# Altium schematic sheet SML-230109PCB2__NFC.SchDoc
size A4; Organization: STAR Electrónica S.L.; Address1: Póligono industrial de Sárdoma; Address2: Avda. do Freixo, 32; Address3: 36214 - Vigo (Pontevedra); Address4: España; DocumentNumber: 2; SheetNumber: 2; SheetTotal: 2
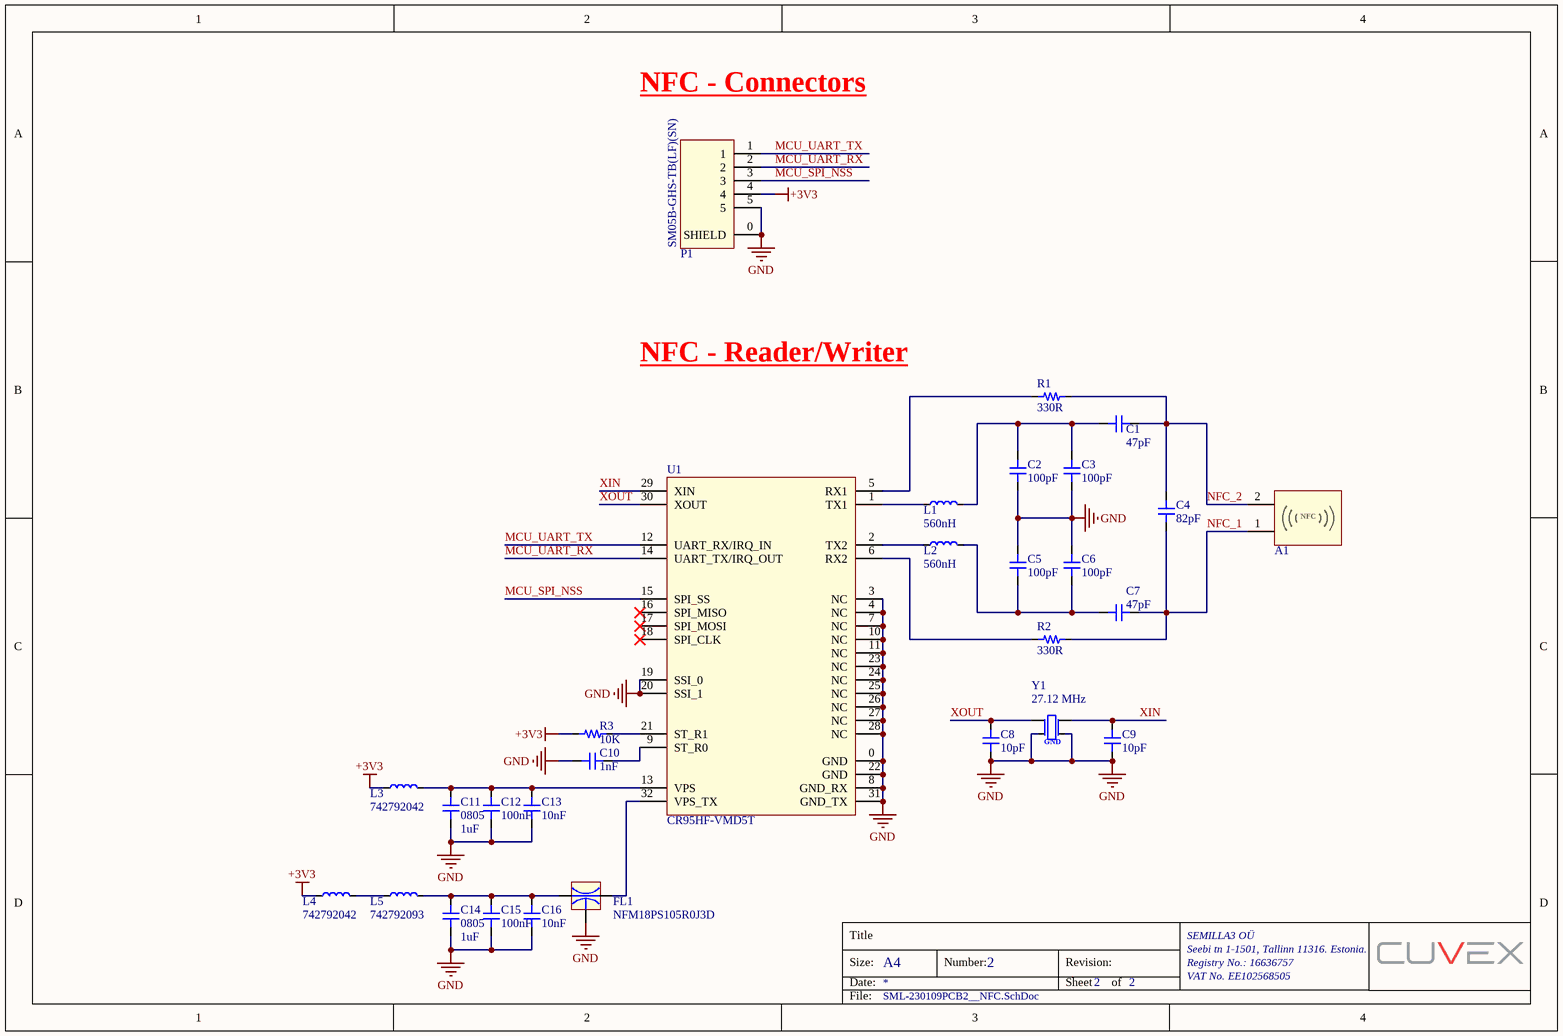
[diagram p0: SML-230109PCB2__NFC.SchDoc]

## Parts
A1  .  [ANT-PCB__NFC-MODEL-1]  (value not drawn)  (net tie, no BOM)
C1  value 47pF  [[G] CAP-MLCC__0603]  (hidden comment: .)
C2  value 100pF  [[G] CAP-MLCC__0603]  (hidden comment: .)
C3  value 100pF  [[G] CAP-MLCC__0603]  (hidden comment: .)
C4  value 82pF  [[G] CAP-MLCC__0603]  (hidden comment: .)
C5  value 100pF  [[G] CAP-MLCC__0603]  (hidden comment: .)
C6  value 100pF  [[G] CAP-MLCC__0603]  (hidden comment: .)
C7  value 47pF  [[G] CAP-MLCC__0603]  (hidden comment: .)
C8  value 10pF  [[G] CAP-MLCC__0603]  (hidden comment: .)
C9  value 10pF  [[G] CAP-MLCC__0603]  (hidden comment: .)
C10  value 1nF  [[G] CAP-MLCC__0603]  (hidden comment: .)
C11  value 1uF  [06] - Package: 0805  [[G] CAP-MLCC__0805]  (hidden comment: .)
C12  value 100nF  [[G] CAP-MLCC__0603]  (hidden comment: .)
C13  value 10nF  [[G] CAP-MLCC__0603]  (hidden comment: .)
C14  value 1uF  [06] - Package: 0805  [[G] CAP-MLCC__0805]  (hidden comment: .)
C15  value 100nF  [[G] CAP-MLCC__0603]  (hidden comment: .)
C16  value 10nF  [[G] CAP-MLCC__0603]  (hidden comment: .)
FL1  .  [EMIFIL-0603__NFM18PS]  (value not drawn)
L1  value 560nH  [[G] IND__0805]  (hidden comment: .)
L2  value 560nH  [[G] IND__0805]  (hidden comment: .)
L3  [01] - MPN Code: 742792042  [[G] IND__0805]  (hidden comment: .)
L4  [01] - MPN Code: 742792042  [[G] IND__0805]  (hidden comment: .)
L5  [01] - MPN Code: 742792093  [[G] IND__0805]  (hidden comment: .)
P1  .  [CONN-SMD__JST(5PIN)__SM05B-GHS-TB(LF)(SN)]  (value not drawn)
R1  value 330R  [[G] RES-CHIP__0603]  (hidden comment: .)
R2  value 330R  [[G] RES-CHIP__0603]  (hidden comment: .)
R3  value 10K  [[G] RES-CHIP__0603]  (hidden comment: .)
U1  CR95HF-VMD5T  [IC-NFC-RDR/WTR__CR95HF__VFQFPN32]
Y1  value 27.12 MHz  [CRYSTAL__ABM8G]  (hidden comment: .)

## Nets
+3V3: L3.1 L4.1 P1.4 R3.1
GND: C2.1 C3.1 C5.2 C6.2 C8.2 C9.2 C10.2 C11.1 C12.1 C13.1 C14.1 C15.1 C16.1 FL1.0 P1.0(SHIELD) P1.5 U1.0(GND) U1.3(NC) U1.4(NC) U1.7(NC) U1.8(GND_RX) U1.10(NC) U1.11(NC) U1.19(SSI_0) U1.20(SSI_1) U1.22(GND) U1.23(NC) U1.24(NC) U1.25(NC) U1.26(NC) U1.27(NC) U1.28(NC) U1.31(GND_TX) Y1.2(gnd) Y1.4(gnd)
MCU_SPI_NSS: P1.3 U1.15(SPI_SS)
MCU_UART_RX: P1.2 U1.14(UART_TX/IRQ_OUT)
MCU_UART_TX: P1.1 U1.12(UART_RX/IRQ_IN)
NFC_1: A1.1 C4.1 C7.2 R2.2
NFC_2: A1.2 C1.2 C4.2 R1.2
XIN: C9.1 U1.29(XIN) Y1.3(OSC2)
XOUT: C8.1 U1.30(XOUT) Y1.1(OSC1)
NetC1_1: C1.1 C2.2 C3.2 L1.2
NetC5_1: C5.1 C6.1 C7.1 L2.2
NetC10_1: C10.1 U1.9(ST_R0)
NetC11_2: C11.2 C12.2 C13.2 L3.2 U1.13(VPS)
NetC14_2: C14.2 C15.2 C16.2 FL1.1 L5.2
NetFL1_2: FL1.2 U1.32(VPS_TX)
NetL1_1: L1.1 U1.1(TX1)
NetL2_1: L2.1 U1.2(TX2)
NetL4_2: L4.2 L5.1
NetR1_1: R1.1 U1.5(RX1)
NetR2_1: R2.1 U1.6(RX2)
NetR3_2: R3.2 U1.21(ST_R1)

Not connected (* = marked no-connect by the designer): U1 16(SPI_MISO)* 17(SPI_MOSI)* 18(SPI_CLK)*

## Notes on the sheet
- NFC - Connectors
- NFC - Reader/Writer
- Title
- Size:
- Date:
- A4
- Number:
- Revision:
- Sheet
- of
- SEMILLA3 OÜ
- Seebi tn 1-1501, Tallinn 11316. Estonia.
- Registry No.: 16636757
- VAT No. EE102568505
- File:
- (in symbol ABM8G-27.120MHZ-10-D1-T) GND
- (in symbol ANT-PCB__NFC-MODEL-1) NFC

## Library data of the parts
A1 = ANT-PCB__NFC-MODEL-1: ANTENNA PCB, NFC, model 1; [06] - Package: 55x45mm; [00] - Description (BOM): ANTENNA PCB, NFC, model 1; [07] - PVP Dealer name: *; [08] - PVP 1K: *; STAR Code: *
C1 C7 = CAP_MLCC_0603: CAP MLCC 0603; [00] - Description (BOM): CAP MLCC 47pF 0603 010; [04] - Power features: 010; STAR Code: C47pF0603010; [06] - Package: 0603; [01] - MPN Code: *; [02] - Manufacturer: *; [03] - Datasheet: *; [05] - Temperature range: *; [07] - PVP Dealer name: *; [08] - PVP 1K: *; Voltage: 010
C2 C3 C5 C6 = CAP_MLCC_0603: CAP MLCC 0603; [00] - Description (BOM): CAP MLCC 100pF 0603 010; [04] - Power features: 010; STAR Code: C100pF0603010; [06] - Package: 0603; [01] - MPN Code: *; [02] - Manufacturer: *; [03] - Datasheet: *; [05] - Temperature range: *; [07] - PVP Dealer name: *; [08] - PVP 1K: *; Voltage: 010
C4 = CAP_MLCC_0603: CAP MLCC 0603; [00] - Description (BOM): CAP MLCC 82pF 0603 010; [04] - Power features: 010; STAR Code: C82pF0603010; [06] - Package: 0603; [01] - MPN Code: *; [02] - Manufacturer: *; [03] - Datasheet: *; [05] - Temperature range: *; [07] - PVP Dealer name: *; [08] - PVP 1K: *; Voltage: 010
C8 C9 = CAP_MLCC_0603: CAP MLCC 0603; [00] - Description (BOM): CAP MLCC 10pF 0603 010; [04] - Power features: 010; STAR Code: C10pF0603010; [06] - Package: 0603; [01] - MPN Code: *; [02] - Manufacturer: *; [03] - Datasheet: *; [05] - Temperature range: *; [07] - PVP Dealer name: *; [08] - PVP 1K: *; Voltage: 010
C10 = CAP_MLCC_0603: CAP MLCC 0603; [00] - Description (BOM): CAP MLCC 1nF 0603 010; [04] - Power features: 010; STAR Code: C1nF0603010; [06] - Package: 0603; [01] - MPN Code: *; [02] - Manufacturer: *; [03] - Datasheet: *; [05] - Temperature range: *; [07] - PVP Dealer name: *; [08] - PVP 1K: *; Voltage: 010
C11 C14 = CAP_MLCC_0805: CAP MLCC 0805; [00] - Description (BOM): CAP MLCC 1uF 0805 010; [04] - Power features: 010; STAR Code: C1uF0805010; [01] - MPN Code: *; [02] - Manufacturer: *; [03] - Datasheet: *; [05] - Temperature range: *; [07] - PVP Dealer name: *; [08] - PVP 1K: *; Voltage: 010
C12 C15 = CAP_MLCC_0603: CAP MLCC 0603; [00] - Description (BOM): CAP MLCC 100nF 0603 010; [04] - Power features: 010; STAR Code: C100nF0603010; [06] - Package: 0603; [01] - MPN Code: *; [02] - Manufacturer: *; [03] - Datasheet: *; [05] - Temperature range: *; [07] - PVP Dealer name: *; [08] - PVP 1K: *; Voltage: 010
C13 C16 = CAP_MLCC_0603: CAP MLCC 0603; [00] - Description (BOM): CAP MLCC 10nF 0603 010; [04] - Power features: 010; STAR Code: C10nF0603010; [06] - Package: 0603; [01] - MPN Code: *; [02] - Manufacturer: *; [03] - Datasheet: *; [05] - Temperature range: *; [07] - PVP Dealer name: *; [08] - PVP 1K: *; Voltage: 010
FL1 = NFM18PS105R0J3D: EMIFIL 0603, Murata, NFM18PS, 1uF, 6'3V, 2A; [05] - Temperature range: -55 to +105 ºC; [06] - Package: NFM18PS (0603); [00] - Description (BOM): EMIFIL 0603, Murata, NFM18PS, 1uF, 6'3V, 2A; [02] - Manufacturer: Murata; [03] - Datasheet: https://www.mouser.es/datasheet/2/281/1/NFM18PS105R0J3_01-1989791.pdf; [04] - Power features: 6'3V, 2A; [07] - PVP Dealer name: *; [08] - PVP 1K: *; STAR Code: *; Voltage: *; Value: 1uF; [01] - MPN Code: NFM18PS105R0J3D
L1 L2 = IND_SMD_0805: IND SMD 0805 [G]; [01] - MPN Code: LQM21NNR56K10D; [00] - Description (BOM): IND 560nH 0805; [06] - Package: 0805; [02] - Manufacturer: *; [03] - Datasheet: *; [04] - Power features: *; [05] - Temperature range: *; [07] - PVP Dealer name: *; [08] - PVP 1K: *; STAR Code: *
L3-L5 = IND_SMD_0805: IND SMD 0805 [G]; [00] - Description (BOM): IND * 0805; [06] - Package: 0805; [02] - Manufacturer: *; [03] - Datasheet: *; [04] - Power features: *; [05] - Temperature range: *; [07] - PVP Dealer name: *; [08] - PVP 1K: *; STAR Code: *; Value: *
P1 = SM05B-GHS-TB(LF)(SN): CONN SMD, JST, side entry, 1x5pin, with lock, 1A, 50V; [04] - Power features: 1A (AC/DC), 50V (AC/DC); [05] - Temperature range: -25 to +85 ºC; [06] - Package: 1x5pin, pitch=1'25mm; Matching connector: GHR-05V-S; [00] - Description (BOM): CONN SMD, JST, side entry, 1x5pin, with lock, 1A, 50V; [02] - Manufacturer: JST; [03] - Datasheet: https://www.jst-mfg.com/product/pdf/eng/eGH.pdf; [07] - PVP Dealer name: *; [08] - PVP 1K: *; STAR Code: *; [01] - MPN Code: SM05B-GHS-TB(LF)(SN)
R1 R2 = RES_SMD_0603: RES SMD 0603 [G]; [00] - Description (BOM): RES 330R OHM 0603 1% 1/10W; [04] - Power features: 100mW; STAR Code: 330R06031%; Tolerance: 1%; [06] - Package: 0603; [01] - MPN Code: *; [02] - Manufacturer: *; [03] - Datasheet: *; [05] - Temperature range: *; [07] - PVP Dealer name: *; [08] - PVP 1K: *
R3 = RES_SMD_0603: RES SMD 0603 [G]; [00] - Description (BOM): RES 10K OHM 0603 1% 1/10W; [04] - Power features: 100mW; STAR Code: 10K06031%; Tolerance: 1%; [06] - Package: 0603; [01] - MPN Code: *; [02] - Manufacturer: *; [03] - Datasheet: *; [05] - Temperature range: *; [07] - PVP Dealer name: *; [08] - PVP 1K: *
U1 = CR95HF-VMD5T: IC NFC READER/WRITER, SPI/UART, 13'56 MHz, Vdd=2'7-3'3V; [02] - Manufacturer: ST Microelectronics; [06] - Package: VFQFPN-32; [05] - Temperature range: -25 to +85 ºC; STAR Code: *; [08] - PVP 1K: *; [07] - PVP Dealer name: *; [04] - Power features: Vdd=2'7-3'3V; [03] - Datasheet: https://www.mouser.es/datasheet/2/389/cr95hf-1848964.pdf; [00] - Description (BOM): IC NFC READER/WRITER, SPI/UART, 13'56 MHz, Vdd=2'7-3'3V; [01] - MPN Code: CR95HF-VMD5T
Y1 = ABM8G-27.120MHZ-10-D1-T: CRYSTAL, 27.1200MHz, ±10ppm, CL=10pF, CS=5pF; [02] - Manufacturer: Abracon LLC; [05] - Temperature range: -40 to +85 ºC; [06] - Package: ABM8G (3.2 x 2.5mm); [00] - Description (BOM): CRYSTAL, 27.1200MHz, ±10ppm, CL=10pF, CS=5pF; [03] - Datasheet: https://www.mouser.es/datasheet/2/3/ABM8G-1608872.pdf; [04] - Power features: *; [07] - PVP Dealer name: *; [08] - PVP 1K: *; STAR Code: *; [01] - MPN Code: ABM8G-27.120MHZ-10-D1-T